# EAGLE schematic zik-pcb-base-gpu-bridge (EAGLE 6.5.0)
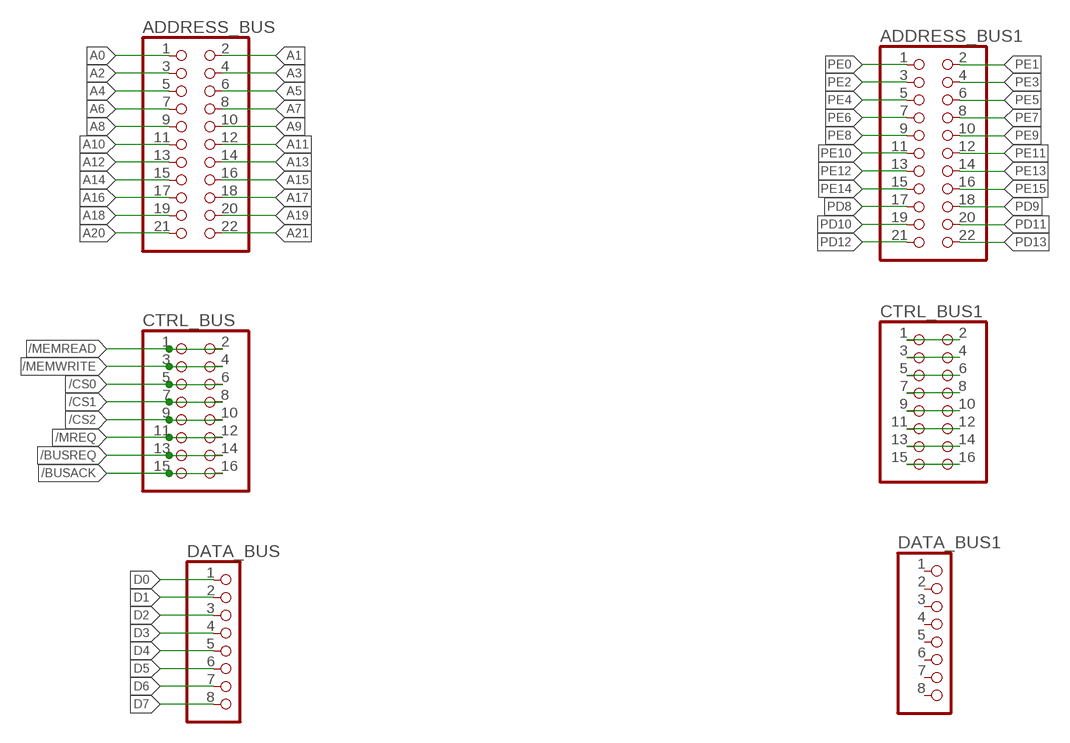
[diagram p0: schematic, sheet 1]

## Parts
ADDRESS_BUS  PINHD-2X11  [2X11]
ADDRESS_BUS1  PINHD-2X11  [2X11]
CTRL_BUS  PINHD-2X8  [2X08]
CTRL_BUS1  PINHD-2X8  [2X08]
DATA_BUS  PINHD-1X8  [1X08]
DATA_BUS1  PINHD-1X8  [1X08]

## Nets
/BUSACK: CTRL_BUS.15 CTRL_BUS.16
/BUSREQ: CTRL_BUS.13 CTRL_BUS.14
/CS0: CTRL_BUS.5 CTRL_BUS.6
/CS1: CTRL_BUS.7 CTRL_BUS.8
/CS2: CTRL_BUS.9 CTRL_BUS.10
/MEMREAD: CTRL_BUS.1 CTRL_BUS.2
/MEMWRITE: CTRL_BUS.3 CTRL_BUS.4
/MREQ: CTRL_BUS.11 CTRL_BUS.12
A0: ADDRESS_BUS.1
A1: ADDRESS_BUS.2
A2: ADDRESS_BUS.3
A3: ADDRESS_BUS.4
A4: ADDRESS_BUS.5
A5: ADDRESS_BUS.6
A6: ADDRESS_BUS.7
A7: ADDRESS_BUS.8
A8: ADDRESS_BUS.9
A9: ADDRESS_BUS.10
A10: ADDRESS_BUS.11
A11: ADDRESS_BUS.12
A12: ADDRESS_BUS.13
A13: ADDRESS_BUS.14
A14: ADDRESS_BUS.15
A15: ADDRESS_BUS.16
A16: ADDRESS_BUS.17
A17: ADDRESS_BUS.18
A18: ADDRESS_BUS.19
A19: ADDRESS_BUS.20
A20: ADDRESS_BUS.21
A21: ADDRESS_BUS.22
D0: DATA_BUS.1
D1: DATA_BUS.2
D2: DATA_BUS.3
D3: DATA_BUS.4
D4: DATA_BUS.5
D5: DATA_BUS.6
D6: DATA_BUS.7
D7: DATA_BUS.8
PB0: CTRL_BUS1.1 CTRL_BUS1.2
PB1: CTRL_BUS1.3 CTRL_BUS1.4
PB2: CTRL_BUS1.5 CTRL_BUS1.6
PB3: CTRL_BUS1.7 CTRL_BUS1.8
PB4: CTRL_BUS1.9 CTRL_BUS1.10
PB5: CTRL_BUS1.11 CTRL_BUS1.12
PB8: CTRL_BUS1.13 CTRL_BUS1.14
PB9: CTRL_BUS1.15 CTRL_BUS1.16
PD8: ADDRESS_BUS1.17
PD9: ADDRESS_BUS1.18
PD10: ADDRESS_BUS1.19
PD11: ADDRESS_BUS1.20
PD12: ADDRESS_BUS1.21
PD13: ADDRESS_BUS1.22
PE0: ADDRESS_BUS1.1
PE1: ADDRESS_BUS1.2
PE2: ADDRESS_BUS1.3
PE3: ADDRESS_BUS1.4
PE4: ADDRESS_BUS1.5
PE5: ADDRESS_BUS1.6
PE6: ADDRESS_BUS1.7
PE7: ADDRESS_BUS1.8
PE8: ADDRESS_BUS1.9
PE9: ADDRESS_BUS1.10
PE10: ADDRESS_BUS1.11
PE11: ADDRESS_BUS1.12
PE12: ADDRESS_BUS1.13
PE13: ADDRESS_BUS1.14
PE14: ADDRESS_BUS1.15
PE15: ADDRESS_BUS1.16
Unconnected: DATA_BUS1.1 DATA_BUS1.2 DATA_BUS1.3 DATA_BUS1.4 DATA_BUS1.5 DATA_BUS1.6 DATA_BUS1.7 DATA_BUS1.8

## Library data of the parts
ADDRESS_BUS ADDRESS_BUS1 = pinhead:PINHD-2X11: PIN HEADER
CTRL_BUS CTRL_BUS1 = pinhead:PINHD-2X8: PIN HEADER
DATA_BUS DATA_BUS1 = pinhead:PINHD-1X8: PIN HEADER